# EAGLE schematic CapstoneREV_12-16-25_1 (EAGLE 9.5.0)
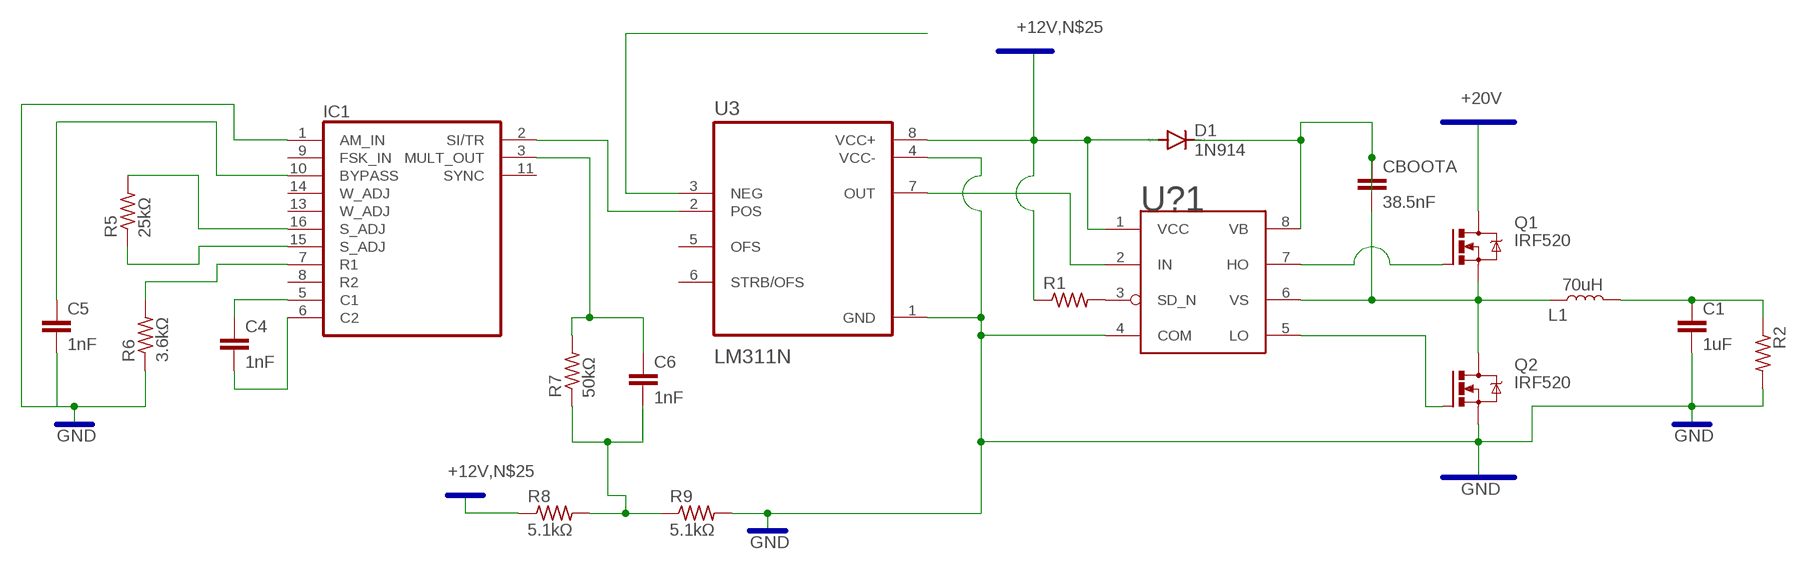
[diagram p0: schematic, sheet 1]

## Parts
C1  1uF  4.7NF-50V-10%(0603)  [0603]
C4  1nF  .1UF-CERCAP-08604  [0402-CAP]
C5  1nF  .1UF-CERCAP-08604  [0402-CAP]
C6  1nF  .1UF-CERCAP-08604  [0402-CAP]
CBOOTA  38.5nF  4.7NF-50V-10%(0603)  [0603]
D1  1N914  1N5060GP  [DO15-12]
IC1  XR-2206  [DIL16]
L1  70uH  1.5UH-2X2-1.4A  [INDUCTOR_2X2]
Q1  IRF520  [TO220BV]
Q2  IRF520  [TO220BV]
R1  R-US_0207/12  [0207/12]
R2  R-US_0207/12  [0207/12]
R5  25kΩ  R-US_0207/12  [0207/12]
R6  3.6kΩ  R-US_0207/12  [0207/12]
R7  50kΩ  R-US_0207/12  [0207/12]
R8  5.1kΩ  R-US_0207/12  [0207/12]
R9  5.1kΩ  R-US_0207/12  [0207/12]
U3  LM311N  [DIP794W45P254L959H508Q8]
U?1  IR2104  [DIP762W46P254L988H533Q8B]

## Nets
+12V: R8.1
+20V: Q1.D
GND: C1.2 IC1.1(AM_IN) Q2.S R2.2 R6.1 R9.2 U3.1(GND) U3.4(VCC-) U?1.4(COM)
N$1: U3.7(OUT) U?1.2(IN)
N$2: CBOOTA.1 D1.C U?1.8(VB)
N$3: CBOOTA.2 L1.P$1 Q1.S Q2.D U?1.6(VS)
N$4: Q1.G U?1.7(HO)
N$5: Q2.G U?1.5(LO)
N$6: R1.2 U?1.3(SD_N)
N$7: C6.1 IC1.3(MULT_OUT) R7.2
N$8: C1.1 L1.P$2 R2.1
N$13: C4.1 IC1.5(C1)
N$14: C4.2 IC1.6(C2)
N$16: IC1.7(R1) R6.2
N$17: IC1.16(S_ADJ) R5.2
N$23: IC1.15(S_ADJ) R5.1
N$24: IC1.2(SI/TR) U3.2(POS)
N$25: D1.A R1.1 U3.8(VCC+) U?1.1(VCC)
N$27: C5.1 IC1.10(BYPASS)
N$28: C5.2
N$29: C6.2 R7.1 R8.2 R9.1
N$31: U3.3(NEG)
Unconnected: IC1.8(R2) IC1.9(FSK_IN) IC1.11(SYNC) IC1.13(W_ADJ) IC1.14(W_ADJ) U3.5(OFS) U3.6(STRB/OFS)

## Buses
+10V,+20V
-10V,GND,N$2
GND
+12V,N$25

## Power pins joined to a net without a drawn wire
GND: IC1.12(GND)
VCC: IC1.4(VCC)

## Library data of the parts
C1 CBOOTA = SparkFun-Retired:4.7NF-50V-10%(0603): CAP-11378; PROD_ID: CAP-11378; VALUE: 4.7nF
C4-C6 = SparkFun-Retired:.1UF-CER: .1uF ceramic SMT CAP-00810- 25V +80%/-20% (0603) CAP-08390- 100V 10% (0603) CAP-08604- 25V 5% (0603); PROD_ID: CAP-08604; VALUE: 0.1uF
D1 = diode:1N5060GP: DIODE controlled avalanche rectifier
IC1 = exar:XR-2206: Monolithic FUNCTION GENERATOR; OC_FARNELL: unknown; OC_NEWARK: unknown
L1 = SparkFun-Coils:1.5UH: FIXED IND 1.5UH 1.4A 120 MOHM; PROD_ID: NDUC-15405; VALUE: 1.5uH
Q1 Q2 = transistor-power:IRF520: HEXFET Power MOSFET
R1 R2 R5-R9 = resistor:R-US_: RESISTOR, American symbol
U3 = LM311N:LM311N: Check availability <https://pricing.snapeda.com/parts/LM311N/NOPB/Texas%20Instruments/view-part?ref=eda>; AVAILABILITY: In Stock; CHECK_PRICES: https://www.snapeda.com/parts/LM311N/NOPB/Texas+Instruments/view-part/?ref=eda; DESCRIPTION: Precision, high voltage, floating output comparator; MF: Texas Instruments; MP: LM311N/NOPB; PACKAGE: PDIP-8 Texas; PRICE: None; SNAPEDA_LINK: https://www.snapeda.com/parts/LM311N/NOPB/Texas+Instruments/view-part/?ref=snap
U?1 = IR2104:IR2104: IR2104 DIP762W46P254L988H533Q8B Half-Bridge Driver